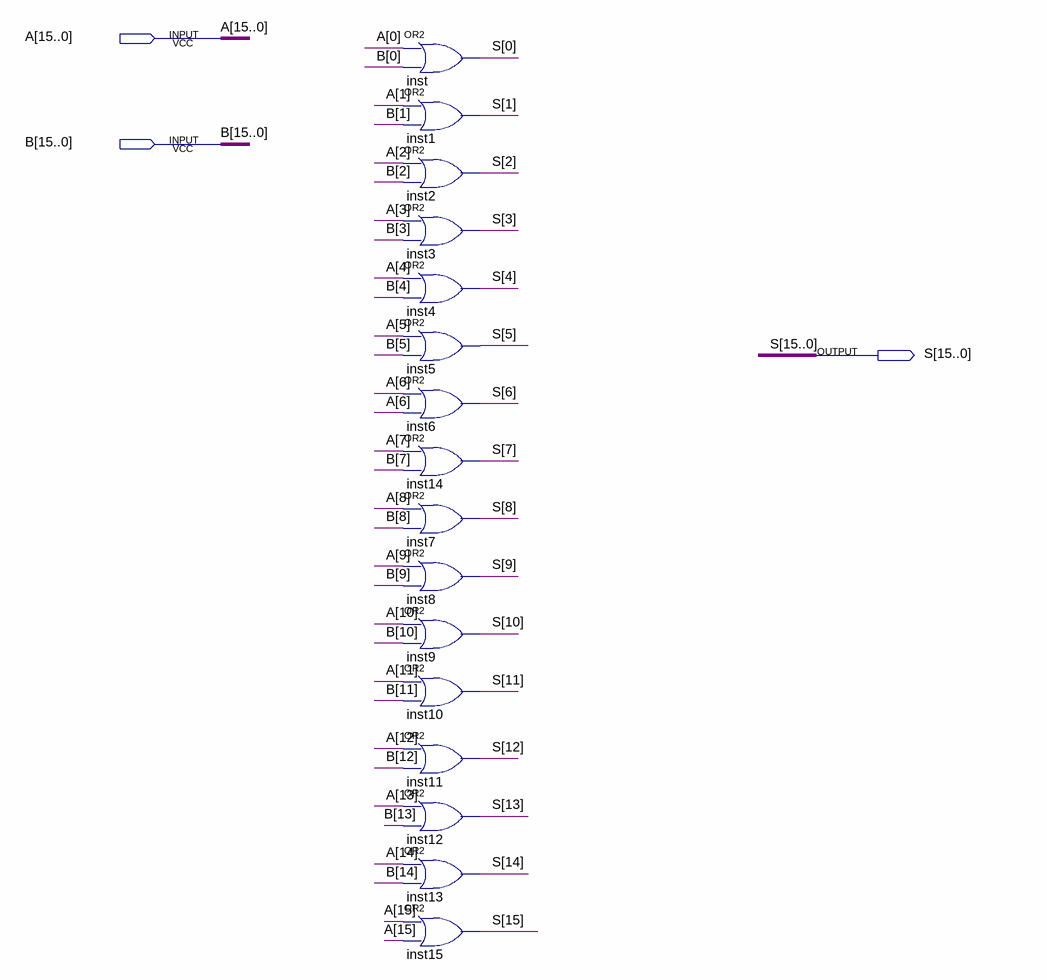
[diagram p0: schematic sheet]
// Quartus schematic 16bitOR.bdf as structural Verilog: 16 symbols, 3 pins
module \16bitOR  (
  input  [15:0] A,
  input  [15:0] B,
  output [15:0] S
);

  or inst (S[0], A[0], B[0]);
  or inst1 (S[1], A[1], B[1]);
  or inst2 (S[2], A[2], B[2]);
  or inst3 (S[3], A[3], B[3]);
  or inst4 (S[4], A[4], B[4]);
  or inst5 (S[5], A[5], B[5]);
  or inst6 (S[6], A[6], A[6]);
  or inst14 (S[7], A[7], B[7]);
  or inst7 (S[8], A[8], B[8]);
  or inst8 (S[9], A[9], B[9]);
  or inst9 (S[10], A[10], B[10]);
  or inst10 (S[11], A[11], B[11]);
  or inst11 (S[12], A[12], B[12]);
  or inst12 (S[13], A[13], B[13]);
  or inst13 (S[14], A[14], B[14]);
  or inst15 (S[15], A[15], A[15]);
endmodule
